# Altium project Quanta.PrjPcb
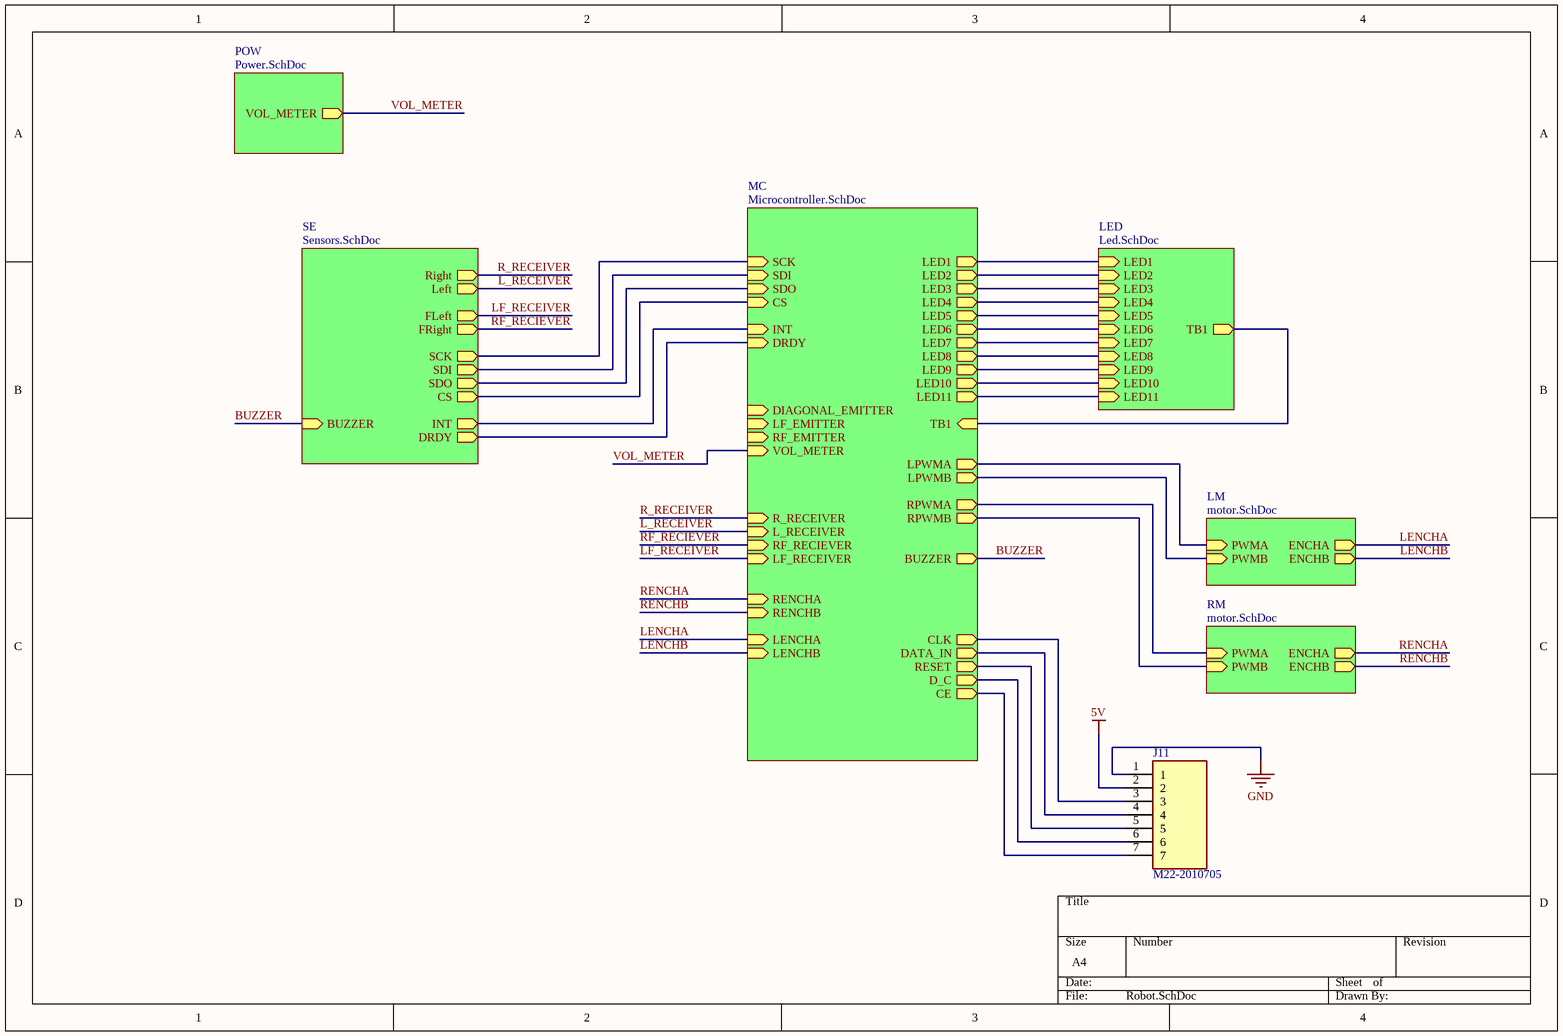
[diagram p0: Robot.SchDoc]
6 sheets, 106 parts. Net scope: hierarchical (ports join the sheet entries above them; power ports are global).
Board file: Robot_PCB.PcbDoc
Sheets:
  Robot.SchDoc
    MC = Microcontroller.SchDoc
    POW = Power.SchDoc
    SE = Sensors.SchDoc
    LED = Led.SchDoc
    LM = motor.SchDoc
    RM = motor.SchDoc

## Sheet Robot.SchDoc
size A4; SheetNumber: 1; SheetTotal: 6

### Parts
J11  M22-2010705  [HDRV7W50P0X200_1X7_1400X200X545P]

### Sub-sheets
LED = Led.SchDoc: LED7 (in), LED9 (in), LED8 (in), LED4 (in), LED11 (in), TB1 (out), LED5 (in), LED10 (in), LED6 (in), LED1 (in), LED2 (in), LED3 (in)
LM = motor.SchDoc: ENCHA (out), PWMB (in), ENCHB (out), PWMA (in)
MC = Microcontroller.SchDoc: LED6 (out), INT (in), RPWMB (out), LED9 (out), LPWMB (out), LPWMA (out), LED11 (out), RPWMA (out), LED1 (out), CS (in), DRDY (in), R_RECEIVER (in), LED5 (out), DIAGONAL_EMITTER (in), SDI (in), TB1 (in), LED10 (out), LED2 (out), LED4 (out), LED3 (out), SCK (in), LED8 (out), L_RECEIVER (in), RENCHB (in), LENCHB (in), LED7 (out), LENCHA (in), LF_EMITTER (in), RENCHA (in), BUZZER (out), SDO (in), RF_EMITTER (in), RF_RECIEVER (in), LF_RECEIVER (in), D_C (out), CE (out), RESET (out), CLK (out), DATA_IN (out), VOL_METER (in)
POW = Power.SchDoc: VOL_METER (out)
RM = motor.SchDoc: ENCHA (out), PWMB (in), ENCHB (out), PWMA (in)
SE = Sensors.SchDoc: Right (out), FLeft (out), FRight (out), Left (out), BUZZER (in), SDO (out), CS (out), DRDY (out), INT (out), SDI (out), SCK (out)

### Nets
5V: J11.2
GND: J11.1  [project net AGND]
BUZZER: sheet MC/BUZZER, sheet SE/BUZZER
L_RECEIVER: sheet MC/L_RECEIVER, sheet SE/Left
LENCHA: sheet MC/LENCHA, sheet LM/ENCHA
LENCHB: sheet MC/LENCHB, sheet LM/ENCHB
LF_RECEIVER: sheet MC/LF_RECEIVER, sheet SE/FLeft
R_RECEIVER: sheet MC/R_RECEIVER, sheet SE/Right
RENCHA: sheet MC/RENCHA, sheet RM/ENCHA
RENCHB: sheet MC/RENCHB, sheet RM/ENCHB
RESET: J11.5 ; sheet MC/RESET
RF_RECIEVER: sheet MC/RF_RECIEVER, sheet SE/FRight
VOL_METER: sheet MC/VOL_METER, sheet POW/VOL_METER
NetIC1_2: sheet MC/SCK, sheet SE/SCK
NetIC1_3: sheet MC/SDI, sheet SE/SDI
NetIC1_4: sheet MC/SDO, sheet SE/SDO
NetIC1_5: sheet MC/CS, sheet SE/CS
NetIC1_6: sheet MC/DRDY, sheet SE/DRDY
NetIC1_7: sheet MC/INT, sheet SE/INT
NetIC2_LM_2: sheet MC/LPWMA, sheet LM/PWMA
NetIC2_LM_4: sheet MC/LPWMB, sheet LM/PWMB
NetIC2_RM_2: sheet MC/RPWMA, sheet RM/PWMA
NetIC2_RM_4: sheet MC/RPWMB, sheet RM/PWMB
NetJ11_3: J11.3 ; sheet MC/CLK
NetJ11_4: J11.4 ; sheet MC/DATA_IN
NetJ11_6: J11.6 ; sheet MC/D_C
NetJ11_7: J11.7 ; sheet MC/CE
NetR12_2: sheet MC/LED1, sheet LED/LED1
NetR13_2: sheet MC/LED2, sheet LED/LED2
NetR14_2: sheet MC/LED3, sheet LED/LED3
NetR15_2: sheet MC/LED4, sheet LED/LED4
NetR16_2: sheet MC/LED5, sheet LED/LED5
NetR17_2: sheet MC/LED6, sheet LED/LED6
NetR18_2: sheet MC/LED7, sheet LED/LED7
NetR19_2: sheet MC/LED8, sheet LED/LED8
NetR20_2: sheet MC/LED9, sheet LED/LED9
NetR21_2: sheet MC/LED10, sheet LED/LED10
NetR22_2: sheet MC/LED11, sheet LED/LED11
NetR23_2: sheet MC/TB1, sheet LED/TB1

### Library data of the parts
J11 = M22-2010705: Connector; Manufacturer_Name: Harwin; Datasheet Link: https://cdn.harwin.com/pdfs/M22-201.pdf; Height: 5.45mm; Manufacturer_Part_Number: M22-2010705; Mouser Part Number: 855-M22-2010705; Mouser Price/Stock: https://www.mouser.co.uk/ProductDetail/Harwin/M22-2010705?qs=xxdqPuaJ%252Ba0YL7fvtvtpQA%3D%3D

## Sheet Microcontroller.SchDoc
size A4; SheetNumber: 4; SheetTotal: 6
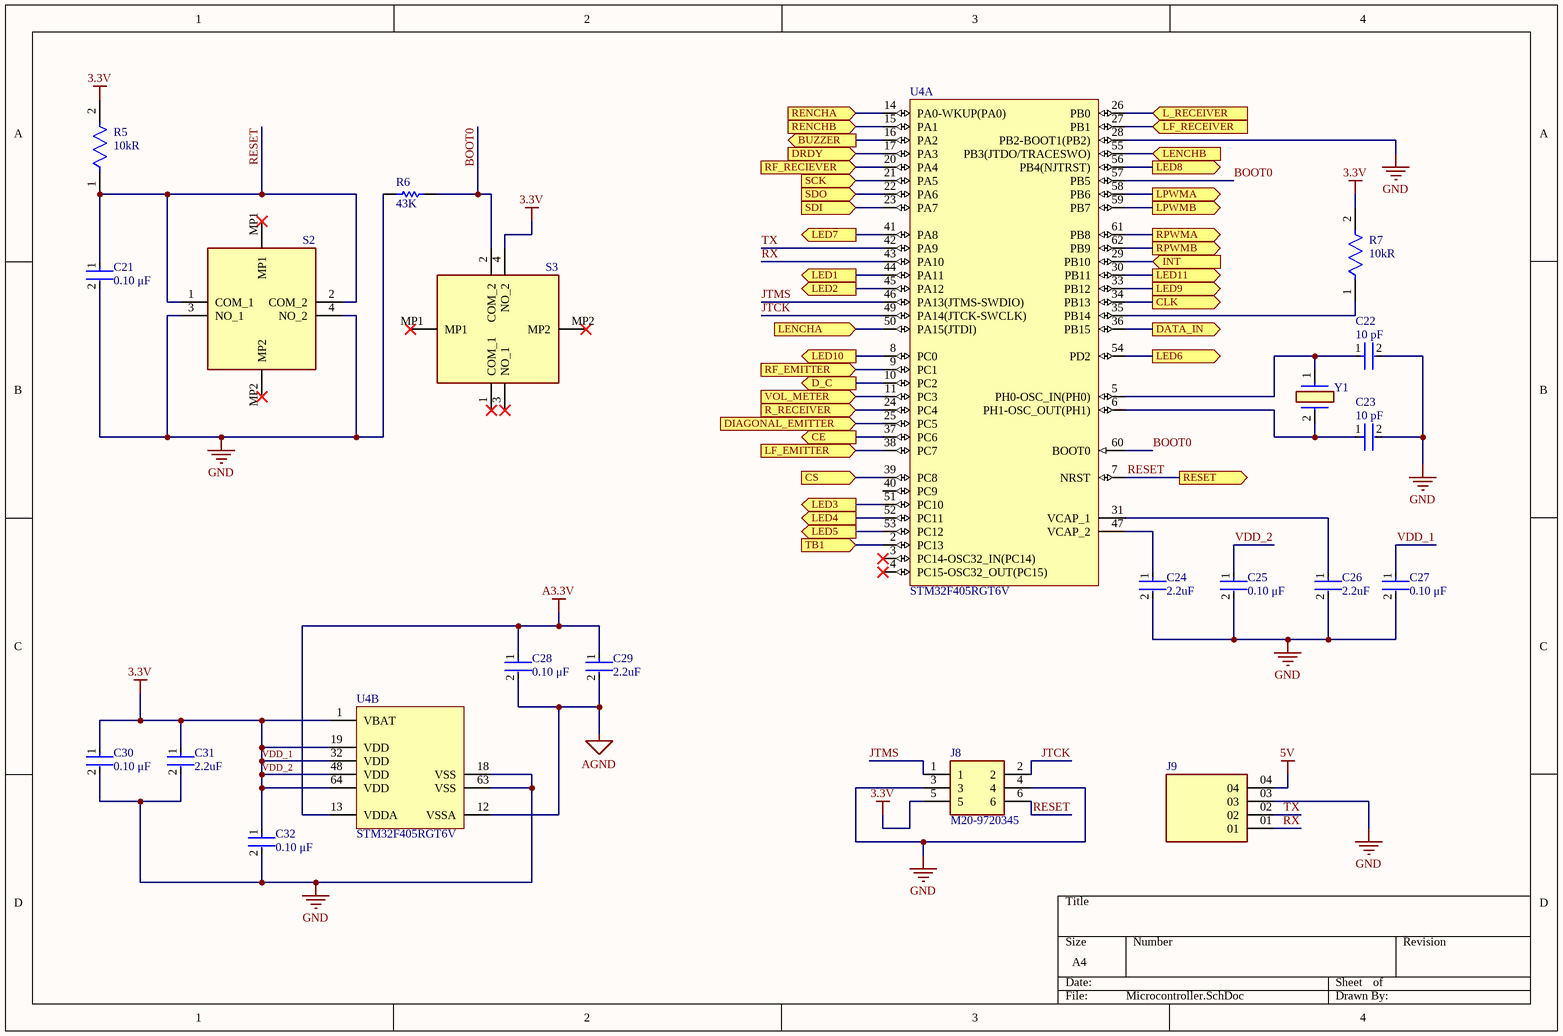
[diagram p1: Microcontroller.SchDoc]

### Parts
C21  value 0.10 μF  [FP-C0805C-DN-MFG]  (hidden comment: C0805C104J8RACTU)
C22  value 10 pF  [FP-C0805C-DN-MFG]  (hidden comment: C0805C100K5GACTU)
C23  value 10 pF  [FP-C0805C-DN-MFG]  (hidden comment: C0805C100K5GACTU)
C24  Capacitance: 2.2uF  [FP-C2012-125-0_2-IPC_C]  (hidden comment: C2012X5R1H225K125AB)
C25  value 0.10 μF  [FP-C0805C-DN-MFG]  (hidden comment: C0805C104J8RACTU)
C26  Capacitance: 2.2uF  [FP-C2012-125-0_2-IPC_C]  (hidden comment: C2012X5R1H225K125AB)
C27  value 0.10 μF  [FP-C0805C-DN-MFG]  (hidden comment: C0805C104J8RACTU)
C28  value 0.10 μF  [FP-C0805C-DN-MFG]  (hidden comment: C0805C104J8RACTU)
C29  Capacitance: 2.2uF  [FP-C2012-125-0_2-IPC_C]  (hidden comment: C2012X5R1H225K125AB)
C30  value 0.10 μF  [FP-C0805C-DN-MFG]  (hidden comment: C0805C104J8RACTU)
C31  Capacitance: 2.2uF  [FP-C2012-125-0_2-IPC_C]  (hidden comment: C2012X5R1H225K125AB)
C32  value 0.10 μF  [FP-C0805C-DN-MFG]  (hidden comment: C0805C104J8RACTU)
J8  M20-9720345  [HDRV6W64P254_2X3_762X508X864P]
J9  TS-104-G-AA  [SAMTEC_TS-104-G-AA]  (value not drawn)
R5  Resistance: 10kR  [FP-ERA3A-IPC_C]  (hidden comment: ERA-3AEB103V)
R6  value 43K  [RESC1608X55X30ML20T20]  (hidden comment: ERA3AEB433V)
R7  Resistance: 10kR  [FP-ERA3A-IPC_C]  (hidden comment: ERA-3AEB103V)
S2  TS21-34-035-BK-160-SMT-TR  [TS2134035BK160SMTTR]  (value not drawn)
S3  TS21-34-035-BK-160-SMT-TR  [TS2134035BK160SMTTR]  (value not drawn)
U4  STM32F405RGT6V  [STM-LQFP64_V]  (parts A,B of 2)
Y1  NX5032GA-16.000M-LN-CD-1  [NX5032GA16000000MHZLNCD1]  (value not drawn)

### Ports
BUZZER (out), CE (out), CLK (out), CS (in), D_C (out), DATA_IN (out), DIAGONAL_EMITTER (in), DRDY (in), INT (in), L_RECEIVER (in), LED1 (out), LED2 (out), LED3 (out), LED4 (out), LED5 (out), LED6 (out), LED7 (out), LED8 (out), LED9 (out), LED10 (out), LED11 (out), LENCHA (in), LENCHB (in), LF_EMITTER (in), LF_RECEIVER (in), LPWMA (out), LPWMB (out), R_RECEIVER (in), RENCHA (in), RENCHB (in), RESET (out), RF_EMITTER (in), RF_RECIEVER (in), RPWMA (out), RPWMB (out), SCK (in), SDI (in), SDO (in), TB1 (in), VOL_METER (in)

### Nets
5V: J9.04
A3.3V: C28.1 C29.1 U4.13(VDDA)
AGND: C21.2 C22.2 C23.2 C24.2 C25.2 C26.2 C27.2 C28.2 C29.2 C30.2 C31.2 C32.2 J8.3 J8.4 J9.03 R6.2 S2.3(NO_1) S2.4(NO_2) U4.12(VSSA) U4.18(VSS) U4.28(PB2-BOOT1(PB2)) U4.63(VSS)  [also labelled GND]
VDD_1: C25.1 C27.1 C30.1 C31.1 C32.1 J8.5 R5.2 R7.2 S3.4(NO_2) U4.1(VBAT) U4.19(VDD) U4.32(VDD) U4.48(VDD) U4.64(VDD)  [also labelled 3.3V, VDD_2]
BOOT0: R6.1 S3.2(COM_2) U4.57(PB5) U4.60(BOOT0)
BUZZER: U4.16(PA2) ; port BUZZER
JTCK: J8.2 U4.49(PA14(JTCK-SWCLK))
JTMS: J8.1 U4.46(PA13(JTMS-SWDIO))
L_RECEIVER: U4.26(PB0) ; port L_RECEIVER
LENCHA: U4.50(PA15(JTDI)) ; port LENCHA
LENCHB: U4.55(PB3(JTDO/TRACESWO)) ; port LENCHB
LF_RECEIVER: U4.27(PB1) ; port LF_RECEIVER
R_RECEIVER: U4.24(PC4) ; port R_RECEIVER
RENCHA: U4.14(PA0-WKUP(PA0)) ; port RENCHA
RENCHB: U4.15(PA1) ; port RENCHB
RESET: C21.1 J8.6 R5.1 S2.1(COM_1) S2.2(COM_2) U4.7(NRST) ; port RESET
RF_RECIEVER: U4.20(PA4) ; port RF_RECIEVER
RX: J9.01 U4.43(PA10)
TX: J9.02 U4.42(PA9)
VOL_METER: U4.11(PC3) ; port VOL_METER
NetC22_1: C22.1 U4.5(PH0-OSC_IN(PH0)) Y1.1(X1)
NetC23_1: C23.1 U4.6(PH1-OSC_OUT(PH1)) Y1.2(X2)
NetC24_1: C24.1 U4.47(VCAP_2)
NetC26_1: C26.1 U4.31(VCAP_1)
NetIC1_2: U4.21(PA5) ; port SCK
NetIC1_3: U4.23(PA7) ; port SDI
NetIC1_4: U4.22(PA6) ; port SDO
NetIC1_5: U4.39(PC8) ; port CS
NetIC1_6: U4.17(PA3) ; port DRDY
NetIC1_7: U4.29(PB10) ; port INT
NetIC2_LM_2: U4.58(PB6) ; port LPWMA
NetIC2_LM_4: U4.59(PB7) ; port LPWMB
NetIC2_RM_2: U4.61(PB8) ; port RPWMA
NetIC2_RM_4: U4.62(PB9) ; port RPWMB
NetJ11_3: U4.34(PB13) ; port CLK
NetJ11_4: U4.36(PB15) ; port DATA_IN
NetJ11_6: U4.10(PC2) ; port D_C
NetJ11_7: U4.37(PC6) ; port CE
NetR7_1: R7.1 U4.35(PB14)
NetR12_2: U4.44(PA11) ; port LED1
NetR13_2: U4.45(PA12) ; port LED2
NetR14_2: U4.51(PC10) ; port LED3
NetR15_2: U4.52(PC11) ; port LED4
NetR16_2: U4.53(PC12) ; port LED5
NetR17_2: U4.54(PD2) ; port LED6
NetR18_2: U4.41(PA8) ; port LED7
NetR19_2: U4.56(PB4(NJTRST)) ; port LED8
NetR20_2: U4.33(PB12) ; port LED9
NetR21_2: U4.8(PC0) ; port LED10
NetR22_2: U4.30(PB11) ; port LED11
NetR23_2: U4.2(PC13) ; port TB1
NetU4_9: U4.9(PC1) ; port RF_EMITTER
NetU4_25: U4.25(PC5) ; port DIAGONAL_EMITTER
NetU4_38: U4.38(PC7) ; port LF_EMITTER

Not connected (* = marked no-connect by the designer): S2 MP1* MP2*; S3 1(COM_1)* 3(NO_1)* MP1* MP2*; U4 3(PC14-OSC32_IN(PC14))* 4(PC15-OSC32_OUT(PC15))* 40(PC9)

### Library data of the parts
C21 C25 C27 C28 C30 C32 = CMP-03020-032188-1: CAP CER 0.1UF 10V 5% X7R 0805; Manufacturer: KEMET; Material: Ceramic; Tolerance: 0.05; Temperature Coefficient: 30ppm/°C; Package: C0805C-DN; Device Class L1: Passive Components; Temperature: -55°C to +125°C; Category: Cap; RoHS: TRUE; Mouser Description: Multilayer Ceramic Capacitors MLCC - SMD/SMT 10volts 0.1uF X7R 5%; Lead Free: Yes; Temperature Range Low: -55°C; Temperature Range High: +125°C; Device Class L2: Capacitors; Temperature Characteristic: X7R; Device Class L3: Ceramic Capacitors; ComponentLink2Description: Datasheet; Automotive: No; Ipc Land Pattern Name: CAPC200125X78; Manufacturer Part Number: C0805C104J8RACTU; Voltage Rating: 10 V; Height: 0.88mm; Digikey Description: CAP CER 0.1UF 10V 5% X7R 0805; Octopart: https://octopart.com/c0805c104j8ractu-kemet-11807087; Capacitance: 0.10 μF; ComponentLink2URL: https://content.kemet.com/datasheets/KEM_C1003_C0G_SMD.pdf
C22 C23 = CMP-2007-00462-2: CAP CER 10PF 50V 10% NP0 0805; Manufacturer: KEMET; Temperature Characteristic: C0G; Material: Ceramic; Temperature Coefficient: 30ppm/°C; Tolerance: 0.1; Package: C0805C-DN; Device Class L2: Capacitors; Mouser Description: Multilayer Ceramic Capacitors MLCC - SMD/SMT 50volts 10pF C0G 10%; ComponentLink2URL: https://content.kemet.com/datasheets/KEM_C1003_C0G_SMD.pdf; Automotive: No; Device Class L3: Ceramic Capacitors; Temperature: -55°C to +125°C; Manufacturer Part Number: C0805C100K5GACTU; Digikey Description: CAP CER 10PF 50V 10% NP0 0805; RoHS: TRUE; Temperature Range High: +125°C; Capacitance: 10 pF; Category: Cap; Voltage Rating: 50 V; Octopart: https://octopart.com/c0805c100k5gactu-kemet-8089747; Height: 0.88mm; Lead Free: Yes; Ipc Land Pattern Name: CAPC200125X78; Temperature Range Low: -55°C; Device Class L1: Passive Components; ComponentLink2Description: Datasheet
C24 C26 C29 C31 = CMP-08246-005698-1: Multilayer Ceramic Capacitors 2.2μF ±10% 50V X5R SMD 0805; Insulation Resistance: 10GR; Dissipation Factor: 5%; Width: 1.2mm; Packaging: Tape and Reel; REACH SVHC: No SVHC; Dielectric: X5R; Dielectric Material: Ceramic; Voltage Rating: 50V; Radiation Hardening: No; Height: 1.25mm; Termination: SMD/SMT; Max Operating Temperature: 85°C; Resistor Type: Ceramic; Package Quantity: 1; Min Operating Temperature: -55°C; Weight: 0.000194oz; Thickness: 0.057inch; Lead Free: Lead Free; Tolerance: 10%; Voltage Rating (DC): 50V; RoHS Compliant: Yes; Construction: Flat; Mount: Surface Mount; Depth: 1.25mm; Length: 2mm; Case Code (Imperial): 0805; Case/Package: 0805; Series: C; Case Code (Metric): 2012
J8 = M20-9720345: Connector; Manufacturer_Name: Harwin; Datasheet Link: https://cdn.harwin.com/pdfs/M20-972.pdf; Height: 8.64mm; Manufacturer_Part_Number: M20-9720345; Mouser Part Number: 855-M20-9720345; Mouser Price/Stock: https://www.mouser.co.uk/ProductDetail/Harwin/M20-9720345?qs=vF78I%252BjhbY8b2N4EUBH%2Fyg%3D%3D
J9 = TS-104-G-AA: MF: Samtec Inc.; Price: None; Package: None; Availability: Unavailable; Value: *; MP: TS-104-G-AA
R5 R7 = CMP-2000-00874-2: RES SMD 10K OHM 0.1% 1/10W 0603; Voltage Rating (DC): 75V; Power Rating: 100mW; Temperature Coefficient: 25ppm/°C; Radiation Hardening: No; Width: 0.8mm; Depth: 0.8mm; Construction: Rectangular; Case Code (Metric): 1608; Package Quantity: 5000; Length: 1.6mm; Size Code: 0603; Case Code (Imperial): 0603; Termination: SMD/SMT; Contact Plating: Tin; Resistance Tolerance: 0.1%; Military Standard: Not; Packaging: Tape and Reel; Max Power Dissipation: 100mW; REACH SVHC: No SVHC; Series: ERA-3A; Voltage Rating: 75V; Lead Free: Lead Free; Technology: METAL FILM; RoHS Compliant: Yes; Max Operating Temperature: 155°C; Resistor Type: Thin Film; Min Operating Temperature: -55°C; Number of Pins: 2; Case/Package: 0603; Tolerance: 0.1%; Height: 0.45mm; Mount: Surface Mount; Number of Terminations: 2
R6 = CMP-2000-00064-1: Manufacturer: Panasonic; Part Number: ERA3AEB433V
S2 S3 = TS21-34-035-BK-160-SMT-TR: Switch; Manufacturer_Name: CUI Devices; Datasheet Link: https://www.cuidevices.com/product/resource/ts21.pdf; Height: 1.7mm; Manufacturer_Part_Number: TS21-34-035-BK-160-SMT-TR; Mouser Part Number: 179-134035BK160SMTTR; Mouser Price/Stock: https://www.mouser.co.uk/ProductDetail/CUI-Devices/TS21-34-035-BK-160-SMT-TR?qs=1Kr7Jg1SGW9zzGN58LP5Sg%3D%3D
U4 = CMP-0243-00092-2: ARM Cortex-M4 32-bit MCU+FPU, 210 DMIPS, 1024 kB Flash, 192 kB Internal RAM, 51 I/Os, 64-pin LQFP, -40 to 85 degC, Tray; Manufacturer: STMicroelectronics; FLASH Size (Prog) (kB): 1024; D/A Converter: 2x12-bit; Supply Voltage(Vcc) min (V): 1.8; Operating Frequency(F) (Processor speed) (MHz): 168; Internal RAM Size (kB): 192; Supply Voltage(Vcc) max (V): 3.6; I/Os (High Current): 51; ComponentLink2URL: http://www.st.com/st-web-ui/static/active/en/resource/technical/document/datasheet/DM00037051.pdf; ComponentLink3URL: http://www.st.com/st-web-ui/static/active/en/resource/technical/document/datasheet/DM00037051.pdf; Mounting Technology: Surface Mount; PackageReference: LQFP64; ComponentLink2Description: Datasheet; Core: ARM Cortex-M4; ComponentLink1Description: Manufacturer URL; ComponentLink1URL: http://www.st.com/web/en/home.html; PartNumber: STM32F405RGT6V; PackageVersion: Rev. 4, 06/2013; Packing: Tray; DatasheetVersion: Rev. 4; PackageDescription: 64-Pin Low Profile Quad Flat Package, 10 x 10 mm Body, 0.5 mm Pitch; ComponentLink3Description: Package Specification
Y1 = NX5032GA-16.000M-LN-CD-1: Crystal or Oscillator; Manufacturer_Name: NDK; Datasheet Link: https://media.digikey.com/pdf/Data%20Sheets/NDK%20PDFs/NX5032GA.pdf; Height: 1.5mm; Manufacturer_Part_Number: NX5032GA-16.000M-LN-CD-1; Mouser Part Number: 344-NX5032GA16MLNCD1; Mouser Price/Stock: https://www.mouser.co.uk/ProductDetail/NDK/NX5032GA-16.000M-LN-CD-1?qs=55YtniHzbhDnyNixVDBwYw%3D%3D

## Sheet Power.SchDoc
size A4; SheetNumber: 2; SheetTotal: 6
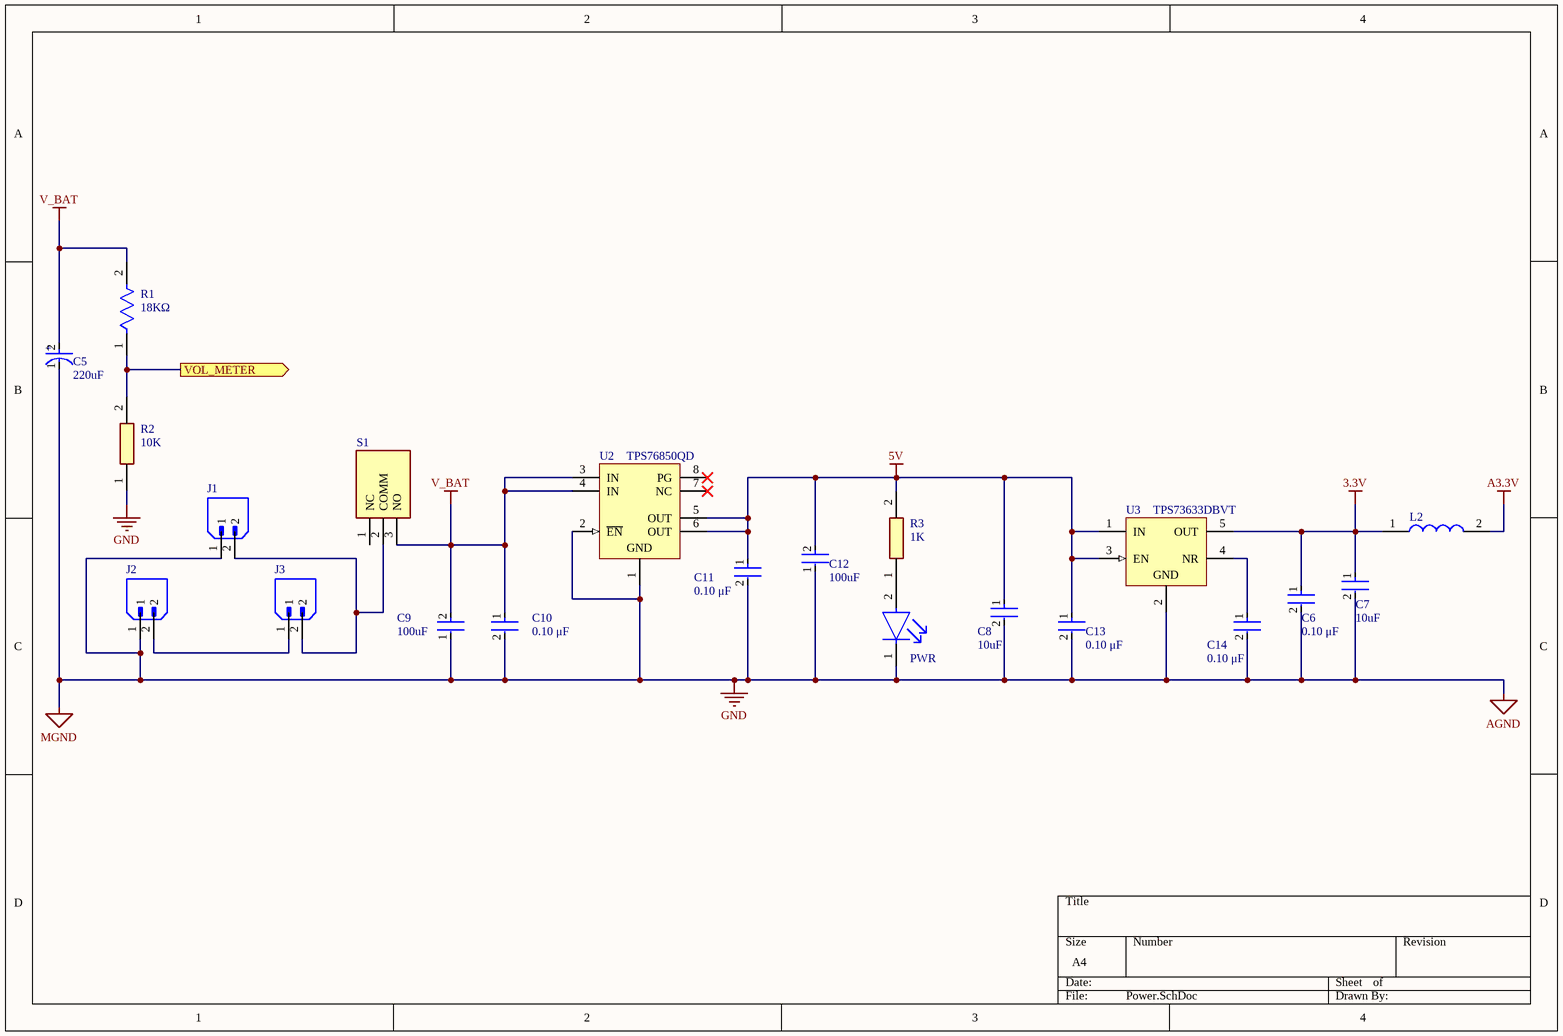
[diagram p2: Power.SchDoc]

### Parts
C5  Capacitance: 220uF  [FP-FTF-MFG]  (hidden comment: EEEFT1H221AP)
C6  value 0.10 μF  [FP-C1206C-EB-MFG]  (hidden comment: C1206C104K1RACTU)
C7  Capacitance: 10uF  [FP-GRM21B-0_1-IPC_C]  (hidden comment: GRM21BR61C106KE15L)
C8  Capacitance: 10uF  [FP-GRM21B-0_1-IPC_C]  (hidden comment: GRM21BR61C106KE15L)
C9  value 100uF  [FP-EMK325A-M-MFG]  (hidden comment: EMK325ABJ107MM-T)
C10  value 0.10 μF  [FP-C1206C-EB-MFG]  (hidden comment: C1206C104K1RACTU)
C11  value 0.10 μF  [FP-C1206C-EB-MFG]  (hidden comment: C1206C104K1RACTU)
C12  value 100uF  [FP-EMK325A-M-MFG]  (hidden comment: EMK325ABJ107MM-T)
C13  value 0.10 μF  [FP-C1206C-EB-MFG]  (hidden comment: C1206C104K1RACTU)
C14  value 0.10 μF  [FP-C1206C-EB-MFG]  (hidden comment: C1206C104K1RACTU)
J1  B2B-XH-A(LF)(SN)  [JST_B2B-XH-A(LF)(SN)]  (value not drawn)
J2  B2B-XH-A(LF)(SN)  [JST_B2B-XH-A(LF)(SN)]  (value not drawn)
J3  B2B-XH-A(LF)(SN)  [JST_B2B-XH-A(LF)(SN)]  (value not drawn)
L2  LBR2012T100K  [INDC2012X145N]  (value not drawn)
PWR  HSMS-C150  [FP-HSMS-C150-MFG]  (value not drawn)
R1  value 18KΩ  [FP-CRGCQ2010-IPC_C]  (hidden comment: CRGCQ2010F18K)
R2  value 10K  [ERJP06D1000V]  (hidden comment: ERJ-P06D1002V)
R3  value 1K  [RESC2013X65N]  (hidden comment: 0805W8F1001T5E)
S1  EG1218  [EG1218]  (value not drawn)
U2  TPS76850QD  [D0008A_L]
U3  TPS73633DBVT  [DBV0005A_M]

### Ports
VOL_METER (out)

### Nets
3.3V: C6.1 C7.1 L2.1 U3.5(OUT)  [project net VDD_1]
5V: C8.1 C11.1 C12.2 C13.1 R3.2 U2.5(OUT) U2.6(OUT) U3.1(IN) U3.3(EN)
A3.3V: L2.2
AGND: C5.1(C) C6.2 C7.2 C8.2 C9.1 C10.2 C11.2 C12.1 C13.2 C14.2 J1.1 J2.1 PWR.1(C) R2.1 U2.1(GND) U2.2(~{EN}) U3.2(GND)  [also labelled GND, MGND]
V_BAT: C5.2(A) C9.2 C10.1 R1.2 S1.3(NO) U2.3(IN) U2.4(IN)
VOL_METER: R1.1 R2.2 ; port VOL_METER
NetC14_1: C14.1 U3.4(NR)
NetJ1_2: J1.2 J3.2 S1.2(COMM)
NetJ2_2: J2.2 J3.1
NetPWR_2: PWR.2(A) R3.1

Not connected (* = marked no-connect by the designer): S1 1(NC); U2 7(NC)* 8(PG)*

### Notes on the sheet
- (in symbol CMP-05427-000092-1) +

### Library data of the parts
C5 = CMP-05427-000092-1: CAP ALUM 220UF 20% 50V SMD; Ripple Current (AC): 670mA; Dielectric Material: Aluminium; Life (Hours): 2000Hour; Leakage Current: 110uA; Lead Diameter: 0.9mm; ESR (Equivalent Series Resistance): 180mR; REACH SVHC: No SVHC; Voltage Rating (DC): 50V; Radiation Hardening: No; Length: 10.2mm; Construction: Cylindrical; Case/Package: Radial; Series: FT; Lead Free: Lead Free; Voltage Rating: 50V; Tolerance: 20%; Contact Plating: Tin; Number of Pins: 2; Height - Seated (Max): 0.413inch; RoHS Compliant: Yes; Diameter: 8mm; Ripple Current: 670mA; Lead Pitch: 3.1mm; Termination: SMD/SMT; Mount: Surface Mount; Min Operating Temperature: -55°C; Max Operating Temperature: 105°C; Voltage: 50V; Height: 10.2mm; Package Quantity: 500; Packaging: Tape and Reel
C6 C10 C11 C13 C14 = CMP-03020-000153-1: CAP CER 0.1UF 100V X7R 1206; Manufacturer: KEMET; Tolerance: 0.1; Material: Ceramic; Temperature Coefficient: 15%; Automotive Grade: Grade 0; Voltage Rating: 100 V; Automotive: Yes; Ipc Land Pattern Name: CAPC320160X78; Device Class L1: Passive Components; ComponentLink2Description: Datasheet; Temperature Range Low: -55°C; Category: Cap; Octopart: https://octopart.com/c1206c104k1ractu-kemet-89521; Height: 0.88mm; Lead Free: Yes; Digikey Description: CAP CER 0.1UF 100V X7R 1206; Mouser Description: CAP CER 0.1UF 100V X7R 1206; Device Class L3: Ceramic Capacitors; Device Class L2: Capacitors; ComponentLink2URL: https://content.kemet.com/datasheets/KEM_C1007_X8R_ULTRA_150C_SMD.pdf; Temperature Range High: +150°C; Temperature Characteristic: X7R; Manufacturer Part Number: C1206C104K1RACTU; RoHS: TRUE; Capacitance: 0.10 μF; Package: C1206C-EB; Temperature: -55°C to +150°C
C7 C8 = CMP-2007-03453-2: Chip Multilayer Ceramic Capacitors for General Purpose, 0805, 10uF, X5R, 15%, 10%, 16V; Radiation Hardening: No; Thickness: 0.053inch; Voltage Rating (DC): 16V; Lead Free: Lead Free; Package Quantity: 1; Width: 1.25mm; Case Code (Imperial): 0805; Depth: 1.25mm; Packaging: Tape and Reel; Dielectric: X5R; Max Operating Temperature: 85°C; Tolerance: 10%; Voltage Rating: 16V; Voltage: 16V; Height: 1.25mm; Case Code (Metric): 2012; Material: Ceramic; Mount: Surface Mount; Case/Package: 0805; REACH SVHC: No SVHC; Length: 2mm; Min Operating Temperature: -55°C; Termination: SMD/SMT
C9 C12 = CMP-2000-05020-2: CAP CER 100UF 16V X5R 1210; Manufacturer: Taiyo Yuden; Material: Ceramic; Temperature Coefficient: 15%; Tolerance: 20%; Ipc Land Pattern Name: CAPC320250X250; Package: EMK325A-M; Device Class L1: Passive Components; Height: 2.8mm; Device Class L2: Capacitors; Temperature Range Low: -55°C; RoHS: TRUE; Temperature Characteristic: X5R; Mouser Description: 1210 100 uF 16 V ±20% Tolerance X5R SMT Multilayer Ceramic Capacitor; ComponentLink2Description: Datasheet; Temperature: -55°C to +85°C; Device Class L3: Ceramic Capacitors; Capacitance: 100uF; Lead Free: Yes; Category: Cap; Octopart: https://octopart.com/emk325abj107mm-t-taiyo+yuden-20815747; Temperature Range High: +85°C; Automotive: No; Manufacturer Part Number: EMK325ABJ107MM-T; Digikey Description: CAP CER 100UF 16V X5R 1210; Voltage Rating: 16V; ComponentLink2URL: https://www.yuden.co.jp/productdata/catalog/mlcc01_e.pdf
J1-J3 = B2B-XH-A(LF)(SN): Connector Header Through Hole 2 position 0.098 (2.50mm); MF: JST Sales America Inc.; SnapEDA_Link: https://www.snapeda.com/parts/B2B-XH-A(LF)(SN)/JST+Sales+America+Inc./view-part/?ref=snap; Package: None; Value: *; MP: B2B-XH-A(LF)(SN); Check_prices: https://www.snapeda.com/parts/B2B-XH-A(LF)(SN)/JST+Sales+America+Inc./view-part/?ref=eda
L2 = LBR2012T100K: Inductor; Manufacturer_Name: TAIYO YUDEN; Datasheet Link: https://componentsearchengine.com/Datasheets/2/LBR2012T100K.pdf; Height: 1.45mm; Manufacturer_Part_Number: LBR2012T100K; Mouser Part Number: 963-LBR2012T100K; Mouser Price/Stock: https://www.mouser.co.uk/ProductDetail/TAIYO-YUDEN/LBR2012T100K?qs=PzICbMaShUet3AhlAozLXg%3D%3D; Arrow Part Number: LBR2012T100K; Arrow Price/Stock: https://www.arrow.com/en/products/lbr2012t100k/taiyo-yuden
PWR = CMP-21615-000001-1: LED RED DIFFUSED CHIP SMD; Luminous Intensity: 10mcd; Power Dissipation: 65mW; Viewing Angle: 170°; Number of Elements: 1; Forward Current: 20mA; Lens Color: White; Lens Style: Rectangular; Wavelength: 626nm; Forward Voltage: 2.1V; Reverse Voltage: 5V; Number of Pins: 2; Color: Red; Lead Free: Lead Free; Width: 1.6mm; Length: 3.2mm; REACH SVHC: No SVHC; Height: 1.1mm; Depth: 1.6mm; Power Rating: 65mW; Package Quantity: 1; Illumination Color: Red; Radiation Hardening: No; Case Code (Imperial): 1206; Max Operating Temperature: 85°C; Test Current: 20mA; Case/Package: 1206; Lens Transparency: Diffused; Number of LEDs: 1; Packaging: Tape and Reel; Mount: Surface Mount; Min Operating Temperature: -40°C; Case Code (Metric): 3216; Dominant Wavelength: 626nm
R1 = CMP-03211-008837-1: CRGCQ2010 18KΩ 0.75W ±100ppm/°C 1% 200V; Manufacturer: TE Connectivity; Automotive Grade: Grade 0; Tolerance: 0.01; Automotive: Yes; Height: 0.65mm; Lead Free: Yes; Series: CRGCQ; Temperature: -55°C to +155°C; Temperature Range Low: -55°C; Composition: Thick Film; Ipc Land Pattern Name: RESC500250X55; Category: Res; Manufacturer Part Number: CRGCQ2010F18K; ComponentLink2Description: Datasheet; Voltage Rating: 200V; RoHS: TRUE; ComponentLink2URL: https://www.te.com/commerce/DocumentDelivery/DDEController?Action=showdoc&DocId=Data+Sheet%7F1773204-3%7F1%7Fpdf%7FEnglish%7FENG_DS_1773204-3_1.pdf%7F4-2176347-976; Power Rating: 0.75W; Device Class L1: Passive Components; Package: CRGCQ2010; Temperature Range High: +155°C; Octopart: https://octopart.com/crgcq2010f18k-te+connectivity-91018464; Device Class L2: Resistors; Device Class L3: Chip SMD Resistors; Ambient Temperature Range High: +70°C; Temperature Coefficient: ±100ppm/°C; Resistance: 18KΩ
R2 = ERJ-P06D1002V: Resistor; Manufacturer_Name: Panasonic; Datasheet Link: http://industrial.panasonic.com/cdbs/www-data/pdf/RDA0000/AOA0000C102.pdf; Height: 0.7mm; Manufacturer_Part_Number: ERJ-P06D1002V; Arrow Part Number: ERJ-P06D1002V; Arrow Price/Stock: https://www.arrow.com/en/products/erj-p06d1002v/panasonic
R3 = 0805W8F1001T5E: Resistor; Manufacturer_Name: ROYALOHM; Datasheet Link: https://www.mouser.de/datasheet/2/1365/1-3044649.pdf; Height: 0.65mm; Manufacturer_Part_Number: 0805W8F1001T5E; Mouser Part Number: 303-0805W8F1001T5E; Mouser Price/Stock: https://www.mouser.co.uk/ProductDetail/Royalohm/0805W8F1001T5E?qs=e8oIoAS2J1RgTTQhbYTt7g%3D%3D
S1 = EG1218: Switch; Manufacturer_Name: E-Switch; Datasheet Link: https://configured-product-images.s3.amazonaws.com/2D/specs/EG1218.pdf; Height: 7.4mm; Manufacturer_Part_Number: EG1218; Mouser Part Number: 612-EG1218; Mouser Price/Stock: https://www.mouser.co.uk/ProductDetail/E-Switch/EG1218?qs=xDsBkp9LkocT0c8K%252B5e%2FgA%3D%3D
U2 = CMP-0395-00120-2: Single Output Fast Transient Response LDO, 1 A, Fixed 5 V Output, 2.7 to 10 V Input, with Low IQ, 8-pin SOIC (D), -40 to 125 degC, Green (RoHS & no Sb/Br); Manufacturer: Texas Instruments; Iq(Typ)(mA): 0.08; Vin(Min)(V): 2.7; Fixed Output Options(V): 5; SubFamily: Single Channel LDO; Iout(Max)(A): 1; Power Good: TRUE; Accuracy(%): 2; Vin(Max)(V): 10; Vdo(Typ)(mV): 230; PartNumber: TPS76850QD; Code_JEDEC: MS-012; ComponentLink2URL: http://www.ti.com/general/docs/lit/getliterature.tsp?genericPartNumber=TPS76850&fileType=pdf; Vout Adj(Min)(V): 5; PackageReference: D0008A; Vout Adj(Max)(V): 5; PackageVersion: 4040047-3/M; ComponentLink3URL: http://www.ti.com/litv/pdf/msoi002j; DatasheetVersion: SLVS211L; PackageDescription: 8-Pin Plastic Small Outline, Body 4.9 x 3.9 mm, Pitch 1.27 mm; ComponentLink1Description: Manufacturer URL; Mounting Technology: Surface Mount; ComponentLink1URL: http://www.ti.com/; Eco-Plan: Green (RoHS & no Sb/Br); ComponentLink2Description: Datasheet; ComponentLink3Description: Package Specification
U3 = CMP-0395-00251-2: Single Output Low Noise LDO, 400 mA, Fixed 3.3 V Output, 1.7 to 5.5 V Input, with Reverse Current Protection, 5-pin SOT-23 (DBV), -40 to 85 degC, Green (RoHS & no Sb/Br); Manufacturer: Texas Instruments; Vin(Min)(V): 1.7; Vin(Max)(V): 5.5; Vout Adj(Min)(V): 3.3; Accuracy(%): 1; SubFamily: Single Channel LDO; Rating: Catalog; Iout(Max)(A): 0.4; Iq(Typ)(mA): 0.3; Vdo(Typ)(mV): 75; ComponentLink1URL: http://www.ti.com/; ComponentLink4URL: Samples URL:http://www.ti.com/product/tps73633#samples; ComponentLink2Description: Datasheet; ComponentLink3URL: http://www.ti.com/litv/pdf/mpds018i; Code_JEDEC: MO-178; ComponentLink4Description: URL Link1; Eco-Plan: Green (RoHS & no Sb/Br); PartNumber: TPS73633DBVT; PackageVersion: 4073253-4/K; ComponentLink2URL: http://www.ti.com/general/docs/lit/getliterature.tsp?genericPartNumber=TPS73633&fileType=pdf; Fixed Output Options(V): 3.3; Mounting Technology: Surface Mount; PackageDescription: 5-Pin Plastic Small Outline, Body 1.60 Ãƒâ€” 2.90 mm, Pitch 0.95 mm; DatasheetVersion: SBVS038T; Vout Adj(Max)(V): 3.3; ComponentLink1Description: Manufacturer URL; ComponentLink3Description: Package Specification; PackageReference: DBV0005A

## Sheet Sensors.SchDoc
size A; SheetNumber: 3; SheetTotal: 6
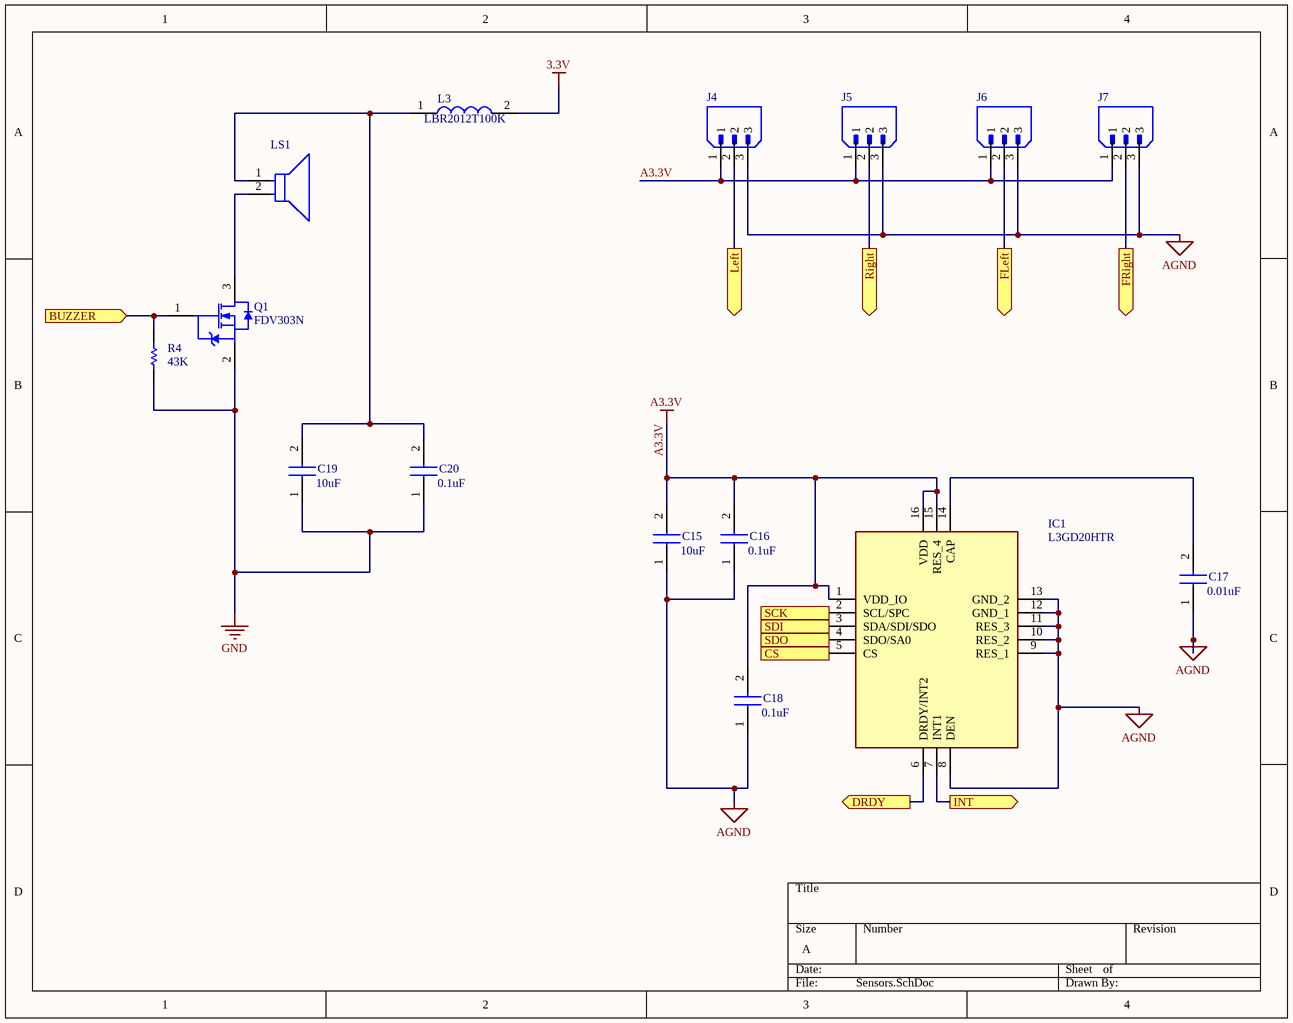
[diagram p3: Sensors.SchDoc]

### Parts
C15  value 10uF  [C0805]  (hidden comment: C0805C106K8PACTU)
C16  value 0.1uF  [C0805]  (hidden comment: C0805C104J8RACTU)
C17  value 0.01uF  [C0805]  (hidden comment: C0805C103K5RACTU)
C18  value 0.1uF  [C0805]  (hidden comment: C0805C104J8RACTU)
C19  value 10uF  [C0805]  (hidden comment: C0805C106K8PACTU)
C20  value 0.1uF  [C0805]  (hidden comment: C0805C104J8RACTU)
IC1  L3GD20HTR  [H3LIS100DLTR]
J4  B3B-XH-A_(LF)(SN)  [JST_B3B-XH-A (LF)(SN)]  (value not drawn)
J5  B3B-XH-A_(LF)(SN)  [JST_B3B-XH-A (LF)(SN)]  (value not drawn)
J6  B3B-XH-A_(LF)(SN)  [JST_B3B-XH-A (LF)(SN)]  (value not drawn)
J7  B3B-XH-A_(LF)(SN)  [JST_B3B-XH-A (LF)(SN)]  (value not drawn)
L3  LBR2012T100K  [INDC2012X145N]
LS1  AI-1223-TWT-3V-2-R  [FP-AI-1223-TWT-3V-2-R-MFG]  (value not drawn)
Q1  FDV303N  [FAIR-FDV303N-3_V]
R4  value 43K  [RESC1608X55X30ML20T20]  (hidden comment: ERA3AEB433V)

### Ports
BUZZER (in), CS (out), DRDY (out), FLeft (out), FRight (out), INT (out), Left (out), Right (out), SCK (out), SDI (out), SDO (out)

### Nets
3.3V: L3.2  [project net VDD_1]
A3.3V: C15.2 C16.2 C18.2 IC1.1(VDD_IO) IC1.15(RES_4) IC1.16(VDD) J4.1 J5.1 J6.1 J7.1
AGND: C15.1 C16.1 C17.1 C18.1 C19.1 C20.1 IC1.8(DEN) IC1.9(RES_1) IC1.10(RES_2) IC1.11(RES_3) IC1.12(GND_1) IC1.13(GND_2) J4.3 J5.3 J6.3 J7.3 Q1.2(S) R4.1  [also labelled GND]
BUZZER: Q1.1(G) R4.2 ; port BUZZER
L_RECEIVER: J4.2 ; port Left
LF_RECEIVER: J6.2 ; port FLeft
R_RECEIVER: J5.2 ; port Right
RF_RECIEVER: J7.2 ; port FRight
NetC17_2: C17.2 IC1.14(CAP)
NetC19_2: C19.2 C20.2 L3.1 LS1.1(C)
NetIC1_2: IC1.2(SCL/SPC) ; port SCK
NetIC1_3: IC1.3(SDA/SDI/SDO) ; port SDI
NetIC1_4: IC1.4(SDO/SA0) ; port SDO
NetIC1_5: IC1.5(CS) ; port CS
NetIC1_6: IC1.6(DRDY/INT2) ; port DRDY
NetIC1_7: IC1.7(INT1) ; port INT
NetLS1_2: LS1.2(A) Q1.3(D)

### Library data of the parts
C15 C19 = C0805C106K8PACTU: Capacitor; Manufacturer_Name: KEMET; Datasheet Link: https://content.kemet.com/datasheets/KEM_C1006_X5R_SMD.pdf; Height: 1.1mm; Manufacturer_Part_Number: C0805C106K8PACTU; Mouser Part Number: 80-C0805C106K8P; Mouser Price/Stock: https://www.mouser.co.uk/ProductDetail/KEMET/C0805C106K8PACTU?qs=Zpyg6gQUYs39C21BeavaKA%3D%3D; Arrow Part Number: C0805C106K8PACTU; Arrow Price/Stock: https://www.arrow.com/en/products/c0805c106k8pactu/kemet-corporation?region=nac
C16 C18 C20 = C0805C104J8RACTU: Capacitor; Manufacturer_Name: KEMET; Datasheet Link: https://content.kemet.com/datasheets/KEM_C1002_X7R_SMD.pdf; Height: 1.1mm; Manufacturer_Part_Number: C0805C104J8RACTU; Mouser Part Number: 80-C0805C104J8R; Mouser Price/Stock: https://www.mouser.co.uk/ProductDetail/KEMET/C0805C104J8RACTU?qs=zZwvocWqSRjRMIheUubV0A%3D%3D; Arrow Part Number: C0805C104J8RACTU; Arrow Price/Stock: https://www.arrow.com/en/products/c0805c104j8ractu/kemet-corporation?region=nac
C17 = C0805C103K5RACTU: Capacitor; Manufacturer_Name: KEMET; Datasheet Link: https://content.kemet.com/datasheets/KEM_C1002_X7R_SMD.pdf; Height: 1.1mm; Manufacturer_Part_Number: C0805C103K5RACTU; Mouser Part Number: 80-C0805C103K5R; Mouser Price/Stock: https://www.mouser.co.uk/ProductDetail/KEMET/C0805C103K5RACTU?qs=cw4evkOYbeJ17Si5k%2FymvA%3D%3D; Arrow Part Number: C0805C103K5RACTU; Arrow Price/Stock: https://www.arrow.com/en/products/c0805c103k5ractu/kemet-corporation?region=nac
IC1 = L3GD20HTR: Integrated Circuit; Manufacturer_Name: STMicroelectronics; Datasheet Link: http://www.st.com/content/ccc/resource/technical/document/datasheet/35/b1/e0/39/71/57/43/01/DM00060659.pdf/files/DM00060659.pdf/jcr:content/translations/en.DM00060659.pdf; Height: 1mm; Manufacturer_Part_Number: L3GD20HTR; Mouser Part Number: 511-L3GD20HTR; Mouser Price/Stock: https://www.mouser.co.uk/ProductDetail/STMicroelectronics/L3GD20HTR?qs=7v3IMFVTeKNoM%2F2Sb4QSlQ%3D%3D; Arrow Part Number: L3GD20HTR; Arrow Price/Stock: https://www.arrow.com/en/products/l3gd20htr/stmicroelectronics?region=nac
J4-J7 = B3B-XH-A_(LF)(SN): Connector Header Through Hole 3 position 0.098 (2.50mm); MF: JST Sales America Inc.; MP: B3B-XH-A (LF)(SN); SnapEDA_Link: https://www.snapeda.com/parts/B3B-XH-A%20(LF)(SN)/JST+Sales+America+Inc./view-part/?ref=snap; Package: None; Value: *; Check_prices: https://www.snapeda.com/parts/B3B-XH-A%20(LF)(SN)/JST+Sales+America+Inc./view-part/?ref=eda
L3 = LBR2012T100K: Inductor; Manufacturer_Name: TAIYO YUDEN; Datasheet Link: https://componentsearchengine.com/Datasheets/2/LBR2012T100K.pdf; Height: 1.45mm; Manufacturer_Part_Number: LBR2012T100K; Mouser Part Number: 963-LBR2012T100K; Mouser Price/Stock: https://www.mouser.co.uk/ProductDetail/TAIYO-YUDEN/LBR2012T100K?qs=PzICbMaShUet3AhlAozLXg%3D%3D; Arrow Part Number: LBR2012T100K; Arrow Price/Stock: https://www.arrow.com/en/products/lbr2012t100k/taiyo-yuden
LS1 = CMP-103888-000003-1: BUZZER MAGNETIC 3V 12MM TH; Min Supply Voltage (DC): 2V; Operating Supply Current: 30mA; Max Supply Voltage (DC): 4V; Input Type: DC; Frequency: 2.3kHz; Series: AI; Nominal Supply Voltage (DC): 3V; Packaging: Tray; Max Operating Temperature: 70°C; Height: 7.5mm; Termination: PC Pins; Max Supply Current: 30mA; Mount: Through Hole; Diameter: 12mm; Voltage Rating: 3V; Sensing Method: Magnetic; Min Operating Temperature: -20°C; Contact Plating: Tin
Q1 = CMP-2000-05111-1: N-Channel MOSFET Transistor, 8 V VGSS, 25 V VDSS, 0.68 A, -55 to 150 degC, 3-Pin SOT23, RoHS, Tape and Reel; Manufacturer: Fairchild; Typical Turn-On Delay Time: 3ns; Channel Mode: Enhancement; RDS-on: 450@4.5VmOhm; Maximum Continuous Drain Current: 0.68A; Maximum Drain Source Voltage: 25V; Rad Hard: No; Typical Fall Time: 13ns; Channel Type: N; Typical Turn-Off Delay Time: 17ns; Maximum Gate Source Voltage: 8V; Typical Rise Time: 8.5ns; Mounting: SurfaceMount; Packaging: Tape&Reel; Manufacturer URL: https://www.fairchildsemi.com/; Datasheet URL: https://datasheet.ciiva.com/22681/1845307-22681736.pdf; Package: 3SOT-23; Category: MOSFET; Operating Temperature: -55to150degC; Datasheet Version: Rev. D2, 07/2014
R4 = CMP-2000-00064-1: Manufacturer: Panasonic; Part Number: ERA3AEB433V

## Sheet Led.SchDoc
size A4; SheetNumber: 6; SheetTotal: 6
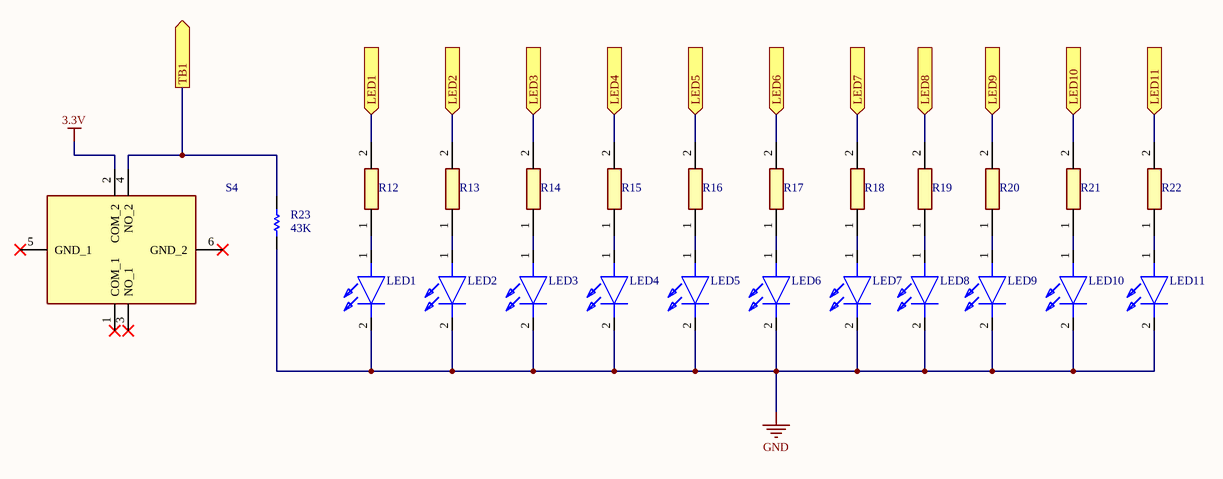
[diagram p4: Led.SchDoc]

### Parts
LED1  598-2105-107F  [5982105107F]  (value not drawn)
LED2  598-2105-107F  [5982105107F]  (value not drawn)
LED3  598-2105-107F  [5982105107F]  (value not drawn)
LED4  598-2105-107F  [5982105107F]  (value not drawn)
LED5  598-2105-107F  [5982105107F]  (value not drawn)
LED6  598-2105-107F  [5982105107F]  (value not drawn)
LED7  598-2105-107F  [5982105107F]  (value not drawn)
LED8  598-2105-107F  [5982105107F]  (value not drawn)
LED9  598-2105-107F  [5982105107F]  (value not drawn)
LED10  598-2105-107F  [5982105107F]  (value not drawn)
LED11  598-2105-107F  [5982105107F]  (value not drawn)
R12  ERJ-U06J102V  [ERJS06_U06_(0805)]  (value not drawn)
R13  ERJ-U06J102V  [ERJS06_U06_(0805)]  (value not drawn)
R14  ERJ-U06J102V  [ERJS06_U06_(0805)]  (value not drawn)
R15  ERJ-U06J102V  [ERJS06_U06_(0805)]  (value not drawn)
R16  ERJ-U06J102V  [ERJS06_U06_(0805)]  (value not drawn)
R17  ERJ-U06J102V  [ERJS06_U06_(0805)]  (value not drawn)
R18  ERJ-U06J102V  [ERJS06_U06_(0805)]  (value not drawn)
R19  ERJ-U06J102V  [ERJS06_U06_(0805)]  (value not drawn)
R20  ERJ-U06J102V  [ERJS06_U06_(0805)]  (value not drawn)
R21  ERJ-U06J102V  [ERJS06_U06_(0805)]  (value not drawn)
R22  ERJ-U06J102V  [ERJS06_U06_(0805)]  (value not drawn)
R23  value 43K  [RESC1608X55X30ML20T20]  (hidden comment: ERA3AEB433V)
S4  PTS526SMG20SMTR21_LFS  [PTS526SMG20SMTR21LFS]  (value not drawn)

### Ports
LED1 (in), LED2 (in), LED3 (in), LED4 (in), LED5 (in), LED6 (in), LED7 (in), LED8 (in), LED9 (in), LED10 (in), LED11 (in), TB1 (out)

### Nets
3.3V: S4.2(COM_2)  [project net VDD_1]
GND: LED1.2(K) LED2.2(K) LED3.2(K) LED4.2(K) LED5.2(K) LED6.2(K) LED7.2(K) LED8.2(K) LED9.2(K) LED10.2(K) LED11.2(K) R23.1  [project net AGND]
NetLED1_1: LED1.1(A) R12.1
NetLED2_1: LED2.1(A) R13.1
NetLED3_1: LED3.1(A) R14.1
NetLED4_1: LED4.1(A) R15.1
NetLED5_1: LED5.1(A) R16.1
NetLED6_1: LED6.1(A) R17.1
NetLED7_1: LED7.1(A) R18.1
NetLED8_1: LED8.1(A) R19.1
NetLED9_1: LED9.1(A) R20.1
NetLED10_1: LED10.1(A) R21.1
NetLED11_1: LED11.1(A) R22.1
NetR12_2: R12.2 ; port LED1
NetR13_2: R13.2 ; port LED2
NetR14_2: R14.2 ; port LED3
NetR15_2: R15.2 ; port LED4
NetR16_2: R16.2 ; port LED5
NetR17_2: R17.2 ; port LED6
NetR18_2: R18.2 ; port LED7
NetR19_2: R19.2 ; port LED8
NetR20_2: R20.2 ; port LED9
NetR21_2: R21.2 ; port LED10
NetR22_2: R22.2 ; port LED11
NetR23_2: R23.2 S4.4(NO_2) ; port TB1

Not connected (* = marked no-connect by the designer): S4 1(COM_1)* 3(NO_1)* 5(GND_1)* 6(GND_2)*

### Library data of the parts
LED1-LED11 = 598-2105-107F: LED; Manufacturer_Name: Dialight; Datasheet Link: https://s3-us-west-2.amazonaws.com/catsy.557/C18686.pdf; Height: 0.8128mm; Manufacturer_Part_Number: 598-2105-107F; Mouser Part Number: 645-598-2105-107F; Mouser Price/Stock: https://www.mouser.co.uk/ProductDetail/Dialight/598-2105-107F?qs=17ckDYBRdemC3ww5qaaOiA%3D%3D
R12-R22 = ERJ-U06J102V: Resistor; Manufacturer_Name: Panasonic; Datasheet Link: https://industrial.panasonic.com/cdbs/www-data/pdf/RDP0000/AOA0000C334.pdf; Height: 0.7mm; Manufacturer_Part_Number: ERJ-U06J102V; Mouser Part Number: 667-ERJ-U06J102V; Mouser Price/Stock: https://www.mouser.com/Search/Refine.aspx?Keyword=667-ERJ-U06J102V
R23 = CMP-2000-00064-1: Manufacturer: Panasonic; Part Number: ERA3AEB433V
S4 = PTS526SMG20SMTR21_LFS: Switch; Manufacturer_Name: C & K COMPONENTS; Manufacturer_Part_Number: PTS526SMG20SMTR21 LFS; Datasheet Link: https://www.ckswitches.com/media/2780/pts526.pdf; Height: 2.15mm; Mouser Part Number: 611-PTS526SMG20S21LF; Mouser Price/Stock: https://www.mouser.co.uk/ProductDetail/CK/PTS526SMG20SMTR21-LFS?qs=MyNHzdoqoQLOqPcVU%2F1RhA%3D%3D; Arrow Part Number: PTS526SMG20SMTR21 LFS; Arrow Price/Stock: https://www.arrow.com/en/products/pts526smg20smtr21-lfs/ck?region=nac

## Sheet motor.SchDoc
size A4; SheetNumber: 5; SheetTotal: 6
Used 2 times, as channels LM, RM. Parts and nets are listed once, with the designators drawn on the sheet.
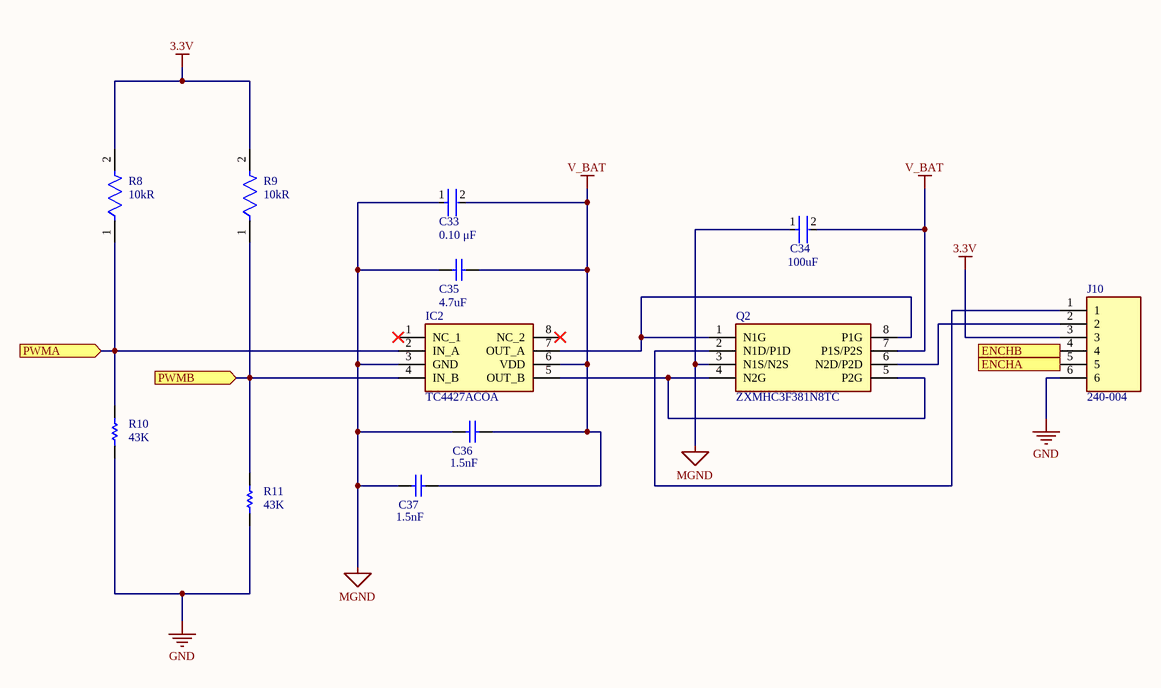
[diagram p5: motor.SchDoc]

### Parts
C33  value 0.10 μF  [FP-C0805C-DN-MFG]  (hidden comment: C0805C104J8RACTU)
C34  Capacitance: 100uF  [FP-C1206C-EH-MFG]  (hidden comment: C1206C107M9PACTU)
C35  value 4.7uF  [CAPC2013X145X50NL20T25]  (hidden comment: C0805C475M3PACTU)
C36  value 1.5nF  [CAPC2013X94X50NL20T25]  (hidden comment: 08051C152KAT2A)
C37  value 1.5nF  [CAPC2013X94X50NL20T25]  (hidden comment: 08051C152KAT2A)
IC2  TC4427ACOA  [SOIC127P600X175-8N]
J10  240-004  [HDRV6W64P0X254_1X6_1524X254X909P]
Q2  ZXMHC3F381N8TC  [SOIC127P600X170-8N]
R8  Resistance: 10kR  [FP-ERA3A-IPC_C]  (hidden comment: ERA-3AEB103V)
R9  Resistance: 10kR  [FP-ERA3A-IPC_C]  (hidden comment: ERA-3AEB103V)
R10  value 43K  [RESC1608X55X30ML20T20]  (hidden comment: ERA3AEB433V)
R11  value 43K  [RESC1608X55X30ML20T20]  (hidden comment: ERA3AEB433V)

### Ports
ENCHA (out), ENCHB (out), PWMA (in), PWMB (in)

### Nets
3.3V: J10.3 R8.2 R9.2
GND: J10.6 R10.1 R11.1
MGND: C33.1 C34.1 C35.1 C36.1 C37.1 IC2.3(GND) Q2.3(N1S/N2S)
V_BAT: C33.2 C34.2 C35.2 C36.2 C37.2 IC2.6(VDD) Q2.7(P1S/P2S)
ENCHA: J10.5 ; port ENCHA
ENCHB: J10.4 ; port ENCHB
PWMA: IC2.2(IN_A) R8.1 R10.2 ; port PWMA
PWMB: IC2.4(IN_B) R9.1 R11.2 ; port PWMB
NetIC2_5: IC2.5(OUT_B) Q2.4(N2G) Q2.5(P2G)
NetIC2_7: IC2.7(OUT_A) Q2.1(N1G) Q2.8(P1G)
NetJ10_1: J10.1 Q2.2(N1D/P1D)
NetJ10_2: J10.2 Q2.6(N2D/P2D)

Not connected (* = marked no-connect by the designer): IC2 1(NC_1)* 8(NC_2)*

### Channels
LM: designators end in _LM; ports ENCHA=LENCHA ENCHB=LENCHB PWMA=NetIC2_LM_2 PWMB=NetIC2_LM_4
RM: designators end in _RM; ports ENCHA=RENCHA ENCHB=RENCHB PWMA=NetIC2_RM_2 PWMB=NetIC2_RM_4

### Library data of the parts
C33 = CMP-03020-032188-1: as C21 on sheet Microcontroller; Package: C0805C-DN; Device Class L1: Passive Components; Temperature: -55°C to +125°C; Category: Cap; RoHS: TRUE; Mouser Description: Multilayer Ceramic Capacitors MLCC - SMD/SMT 10volts 0.1uF X7R 5%; Lead Free: Yes; Temperature Range Low: -55°C; Temperature Range High: +125°C; Device Class L2: Capacitors; Temperature Characteristic: X7R; Device Class L3: Ceramic Capacitors; ComponentLink2Description: Datasheet; Automotive: No; Ipc Land Pattern Name: CAPC200125X78; Manufacturer Part Number: C0805C104J8RACTU; Voltage Rating: 10 V; Height: 0.88mm; Digikey Description: CAP CER 0.1UF 10V 5% X7R 0805; Octopart: https://octopart.com/c0805c104j8ractu-kemet-11807087; Capacitance: 0.10 μF; ComponentLink2URL: https://content.kemet.com/datasheets/KEM_C1003_C0G_SMD.pdf
C34 = CMP-1037-05005-3: CAP CER 100UF 6.3V X5R 1206; Dielectric Material: Ceramic; Tolerance: 2%; Dissipation Factor: 5%; Min Operating Temperature: -55°C; Case Code (Imperial): 1206; Case Code (Metric): 3216; Depth: 1.6mm; Dielectric: X5R; Max Operating Temperature: 85°C; Packaging: Tape and Reel; Construction: Flat; Series: C; Case/Package: 1206; Radiation Hardening: No; Voltage Rating (DC): 6.3V; Termination: SMD/SMT; Voltage Rating: 6.3V; Number of Pins: 2; RoHS Compliant: Yes; Height: 1.6mm; Lead Free: Lead Free; Voltage: 6.3V; REACH SVHC: No SVHC; Length: 3.2mm; Mount: Surface Mount; Package Quantity: 1; Thickness: 0.071inch; Width: 0.063inch
C35 = CMP-2007-01014-1: Manufacturer: Kemet; Part Number: C0805C475M3PACTU
C36 C37 = CMP-2007-04179-1: Manufacturer: AVX Interconnect / Elco; Part Number: 08051C152KAT2A
IC2 = TC4427ACOA: Integrated Circuit; Manufacturer_Name: Microchip; Datasheet Link: https://datasheet.datasheetarchive.com/originals/distributors/Datasheets-306/110017.pdf; Height: 1.75mm; Manufacturer_Part_Number: TC4427ACOA; Mouser Part Number: 579-TC4427ACOA; Mouser Price/Stock: https://www.mouser.co.uk/ProductDetail/Microchip-Technology/TC4427ACOA?qs=g6BBfX6YTklnRUZ4V7kDWA%3D%3D; Arrow Part Number: TC4427ACOA; Arrow Price/Stock: https://www.arrow.com/en/products/tc4427acoa/microchip-technology?utm_currency=USD&region=europe
J10 = 240-004: Connector; Manufacturer_Name: Digilent; Datasheet Link: https://digilent.com/reference/_media/reference/test-and-measurement/6-pin-header-gender-changer/163-068-2.pdf; Height: 9.09mm; Manufacturer_Part_Number: 240-004; Arrow Part Number: 240-004; Arrow Price/Stock: https://www.arrow.com/en/products/240-004/digilent?region=nac
Q2 = ZXMHC3F381N8TC: MOSFET (N-Channel); Manufacturer_Name: Diodes Incorporated; Datasheet Link: https://www.diodes.com//assets/Datasheets/ZXMHC3F381N8.pdf; Height: 1.7mm; Manufacturer_Part_Number: ZXMHC3F381N8TC; Mouser Part Number: 522-ZXMHC3F381N8TC; Mouser Price/Stock: https://www.mouser.co.uk/ProductDetail/Diodes-Incorporated/ZXMHC3F381N8TC?qs=7E5rbXJDVJoJr15tcLBfrA%3D%3D; Arrow Part Number: ZXMHC3F381N8TC; Arrow Price/Stock: https://www.arrow.com/en/products/zxmhc3f381n8tc/diodes-incorporated?region=nac
R8 R9 = CMP-2000-00874-2: as R5 on sheet Microcontroller; Radiation Hardening: No; Width: 0.8mm; Depth: 0.8mm; Construction: Rectangular; Case Code (Metric): 1608; Package Quantity: 5000; Length: 1.6mm; Size Code: 0603; Case Code (Imperial): 0603; Termination: SMD/SMT; Contact Plating: Tin; Resistance Tolerance: 0.1%; Military Standard: Not; Packaging: Tape and Reel; Max Power Dissipation: 100mW; REACH SVHC: No SVHC; Series: ERA-3A; Voltage Rating: 75V; Lead Free: Lead Free; Technology: METAL FILM; RoHS Compliant: Yes; Max Operating Temperature: 155°C; Resistor Type: Thin Film; Min Operating Temperature: -55°C; Number of Pins: 2; Case/Package: 0603; Tolerance: 0.1%; Height: 0.45mm; Mount: Surface Mount; Number of Terminations: 2
R10 R11 = CMP-2000-00064-1: Manufacturer: Panasonic; Part Number: ERA3AEB433V

## Nets that join several sheets
5V: Robot (J11.2), Microcontroller (J9.04), Power (9 pins)
A3.3V: Microcontroller (C28.1 C29.1 U4.13), Power (L2.2), Sensors (10 pins)
AGND: Robot (J11.1), Microcontroller (22 pins), Power (17 pins), Sensors (18 pins), Led (12 pins), LM (10 pins), RM (10 pins)
V_BAT: Power (7 pins), LM (7 pins), RM (7 pins)
VDD_1: Microcontroller (14 pins), Power (C6.1 C7.1 L2.1 U3.5), Sensors (L3.2), Led (S4.2), LM (J10_LM.3 R8_LM.2 R9_LM.2), RM (J10_RM.3 R8_RM.2 R9_RM.2)
BUZZER: Microcontroller (U4.16), Sensors (Q1.1 R4.2)
L_RECEIVER: Microcontroller (U4.26), Sensors (J4.2)
LENCHA: Microcontroller (U4.50), LM (J10_LM.5)
LENCHB: Microcontroller (U4.55), LM (J10_LM.4)
LF_RECEIVER: Microcontroller (U4.27), Sensors (J6.2)
NetIC1_2: Microcontroller (U4.21), Sensors (IC1.2)
NetIC1_3: Microcontroller (U4.23), Sensors (IC1.3)
NetIC1_4: Microcontroller (U4.22), Sensors (IC1.4)
NetIC1_5: Microcontroller (U4.39), Sensors (IC1.5)
NetIC1_6: Microcontroller (U4.17), Sensors (IC1.6)
NetIC1_7: Microcontroller (U4.29), Sensors (IC1.7)
NetIC2_LM_2: Microcontroller (U4.58), LM (IC2_LM.2 R8_LM.1 R10_LM.2)
NetIC2_LM_4: Microcontroller (U4.59), LM (IC2_LM.4 R9_LM.1 R11_LM.2)
NetIC2_RM_2: Microcontroller (U4.61), RM (IC2_RM.2 R8_RM.1 R10_RM.2)
NetIC2_RM_4: Microcontroller (U4.62), RM (IC2_RM.4 R9_RM.1 R11_RM.2)
NetJ11_3: Robot (J11.3), Microcontroller (U4.34)
NetJ11_4: Robot (J11.4), Microcontroller (U4.36)
NetJ11_6: Robot (J11.6), Microcontroller (U4.10)
NetJ11_7: Robot (J11.7), Microcontroller (U4.37)
NetR12_2: Microcontroller (U4.44), Led (R12.2)
NetR13_2: Microcontroller (U4.45), Led (R13.2)
NetR14_2: Microcontroller (U4.51), Led (R14.2)
NetR15_2: Microcontroller (U4.52), Led (R15.2)
NetR16_2: Microcontroller (U4.53), Led (R16.2)
NetR17_2: Microcontroller (U4.54), Led (R17.2)
NetR18_2: Microcontroller (U4.41), Led (R18.2)
NetR19_2: Microcontroller (U4.56), Led (R19.2)
NetR20_2: Microcontroller (U4.33), Led (R20.2)
NetR21_2: Microcontroller (U4.8), Led (R21.2)
NetR22_2: Microcontroller (U4.30), Led (R22.2)
NetR23_2: Microcontroller (U4.2), Led (R23.2 S4.4)
R_RECEIVER: Microcontroller (U4.24), Sensors (J5.2)
RENCHA: Microcontroller (U4.14), RM (J10_RM.5)
RENCHB: Microcontroller (U4.15), RM (J10_RM.4)
RESET: Robot (J11.5), Microcontroller (6 pins)
RF_RECIEVER: Microcontroller (U4.20), Sensors (J7.2)
VOL_METER: Microcontroller (U4.11), Power (R1.1 R2.2)